# Altium schematic sheet [07] - PERIPHERALS.SchDoc
size A4
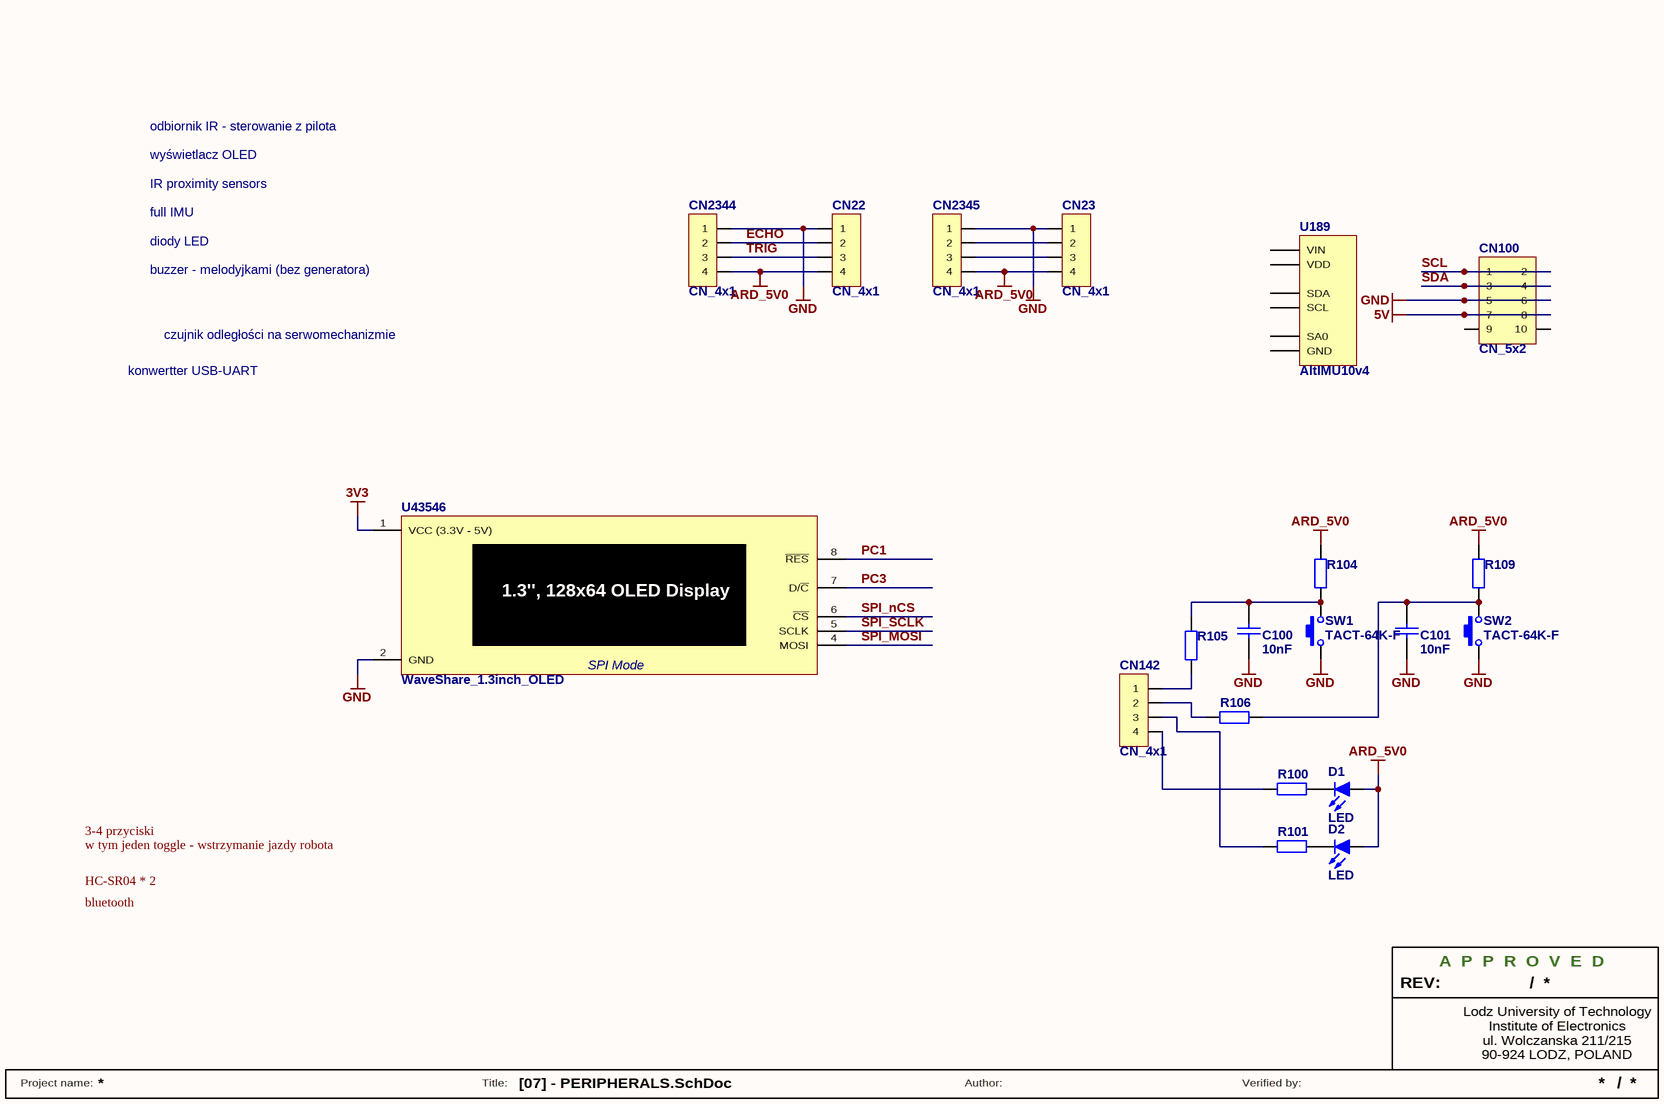
[diagram p0: [07] - PERIPHERALS.SchDoc]

## Parts
C100  10nF  [C0805]
C101  10nF  [C0805]
CN22  CN_4x1  [GP_4x1H_F]
CN23  CN_4x1  [GP_4x1H_F]
CN100  CN_5x2  [GP_5x2H_F]
CN142  CN_4x1  [GP_4x1]
CN2344  CN_4x1  [GP_4x1]
CN2345  CN_4x1  [GP_4x1]
D1  LED  [LED-Polarized - 3mm]
D2  LED  [LED-Polarized - 3mm]
R100  (no value)  [R0805]
R101  (no value)  [R0805]
R104  (no value)  [R0805]
R105  (no value)  [R0805]
R106  (no value)  [R0805]
R109  (no value)  [R0805]
SW1  TACT-64K-F  [TACT-64K-F]
SW2  TACT-64K-F  [TACT-64K-F]
U189  AltIMU10v4  [AltIMU-10 v4]
U43546  WaveShare_1.3inch_OLED  [WaveShare_1.3INCH_OLED]

## Nets
3V3: U43546.1(VCC_(3.3V_-_5V))
5V: CN100.7 CN100.8
ARD_5V0: CN22.4 CN23.4 CN2344.4 CN2345.4 D1.1(A) D2.1(A) R104.2 R109.2
GND: C100.1 C101.1 CN22.1 CN23.1 CN100.5 CN100.6 CN2344.1 CN2345.1 SW1.1 SW2.1 U43546.2(GND)
ECHO: CN22.2 CN2344.2
PC1: U43546.8(~{RES})
PC3: U43546.7(NC_/_SDAOUT)
SCL: CN100.1 CN100.2
SDA: CN100.3 CN100.4
SPI_MOSI: U43546.4(MOSI)
SPI_nCS: U43546.6(~{CS})
SPI_SCLK: U43546.5(SCLK)
TRIG: CN22.3 CN2344.3
NetC100_2: C100.2 R104.1 R105.2 SW1.2
NetC101_2: C101.2 R106.2 R109.1 SW2.2
NetCN23_2: CN23.2 CN2345.2
NetCN23_3: CN23.3 CN2345.3
NetCN142_1: CN142.1 R105.1
NetCN142_2: CN142.2 R106.1
NetCN142_3: CN142.3 R101.1
NetCN142_4: CN142.4 R100.1
NetD1_2: D1.2(K) R100.2
NetD2_2: D2.2(K) R101.2

Not connected (* = marked no-connect by the designer): CN100 9 10; U189 1(GND) 2(SA0) 3(VIN) 4(VDD) 5(SDA) 6(SCL)

## Notes on the sheet
- odbiornik IR - sterowanie z pilota
- wyświetlacz OLED
- IR proximity sensors
- full IMU
- diody LED
- buzzer - melodyjkami (bez generatora)
- konwertter USB-UART
- czujnik odległości na serwomechanizmie
- Labels drawn without touching a wire or pin: 3-4 przyciski, bluetooth, HC-SR04 * 2, w tym jeden toggle - wstrzymanie jazdy robota
- REV:
- A  P  P  R  O  V  E  D
- /
- Lodz University of Technology
- ul. Wolczanska 211/215
- 90-924 LODZ, POLAND
- Institute of Electronics
- Project name:
- Title:
- Author:
- Verified by:
- (in symbol WaveShare_1.3inch_OLED) 1.3'', 128x64 OLED Display; SPI Mode

## Library data of the parts
C100 C101 = Cap: Capacitor; ComponentLink1Description: datasheet; ComponentLink2Description: supplier; Value: 10nF
D1 D2 = LED: Typical RED, GREEN, YELLOW, AMBER GaAs LED; Published: 04-Apr-2006
R100 R101 R104-R106 R109 = Res: Resistor; Published: 19-Feb-2006; ComponentLink1Description: datasheet; ComponentLink2Description: supplier
SW1 SW2 = TACT-64K-F: 6x6mm THT Tactile SPST-NO Switch; Published: 30-Jun-2006
U189 = AltIMU10v4: Pololu Gyro, Accelerometer, Compass, and Altimeter (L3GD20H, LSM303D, and LPS25H Carrier)
U43546 = WaveShare_1.3inch_OLED: DEP096032B-W OLED Display